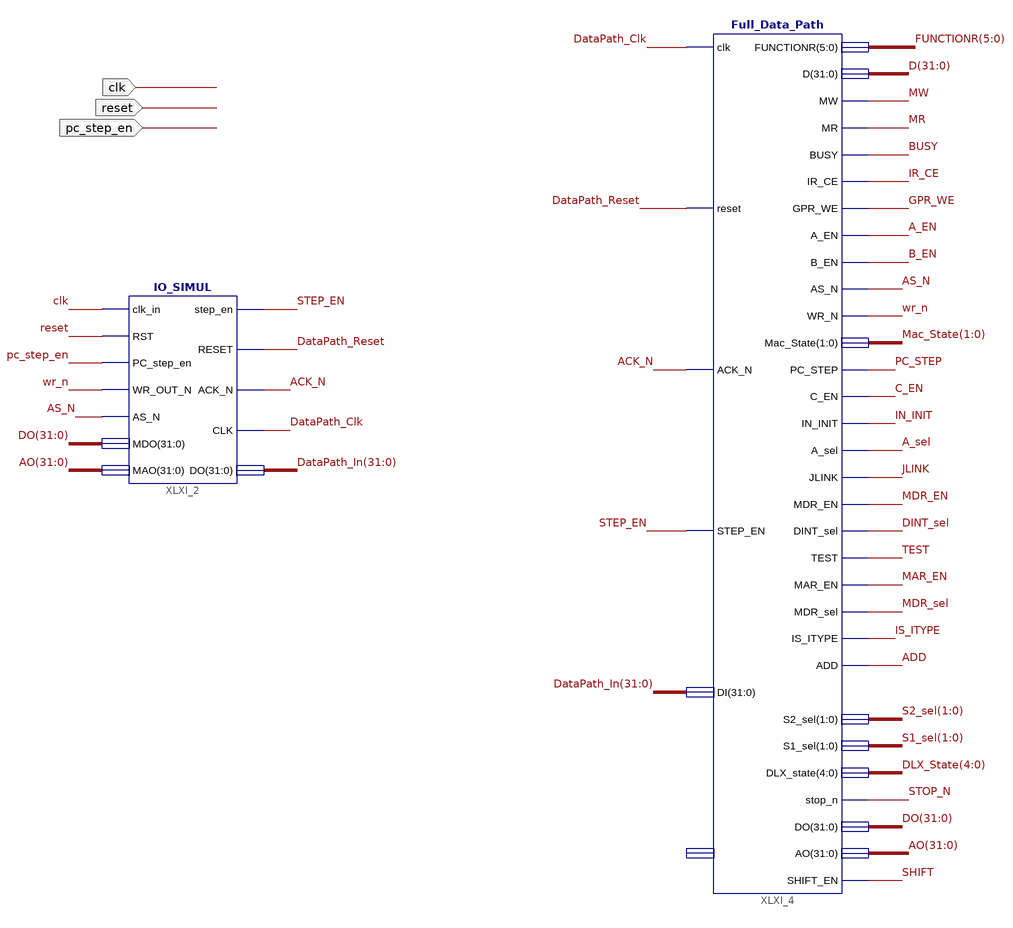
[diagram p0: schematic sheet 1]
// Xilinx ISE schematic IOSIM_DATA_P.sch (spartan6) as structural Verilog: 2 symbols, 3 ports
module IOSIM_DATA_P (
  input  reset,
  input  clk,
  input  pc_step_en
);

  wire A_EN, A_sel, ACK_N, ADD, AS_N, B_EN, BUSY, C_EN, DataPath_Clk, DataPath_Reset, DINT_sel, GPR_WE,
       IN_INIT, IR_CE, IS_ITYPE, JLINK, MAR_EN, MDR_EN, MDR_sel, MR, MW, PC_STEP, SHIFT, STEP_EN, STOP_N,
       TEST, wr_n;
  wire [1:0] Mac_State, S1_sel, S2_sel;
  wire [4:0] DLX_State;
  wire [5:0] FUNCTIONR;
  wire [31:0] AO, D, DataPath_In, DO;

  Full_Data_Path XLXI_4 (
    .clk(DataPath_Clk), .reset(DataPath_Reset), .ACK_N(ACK_N), .STEP_EN(STEP_EN), .DI(DataPath_In),
    .FUNCTIONR(FUNCTIONR), .D(D), .MW(MW), .MR(MR), .BUSY(BUSY), .IR_CE(IR_CE), .GPR_WE(GPR_WE), .A_EN(A_EN),
    .B_EN(B_EN), .AS_N(AS_N), .WR_N(wr_n), .Mac_State(Mac_State), .PC_STEP(PC_STEP), .C_EN(C_EN),
    .IN_INIT(IN_INIT), .A_sel(A_sel), .JLINK(JLINK), .MDR_EN(MDR_EN), .DINT_sel(DINT_sel), .TEST(TEST),
    .MAR_EN(MAR_EN), .MDR_sel(MDR_sel), .IS_ITYPE(IS_ITYPE), .ADD(ADD), .S2_sel(S2_sel), .S1_sel(S1_sel),
    .DLX_state(DLX_State), .stop_n(STOP_N), .DO(DO), .AO(AO), .SHIFT_EN(SHIFT));  // open: DD
  IO_SIMUL XLXI_2 (
    .clk_in(clk), .RST(reset), .PC_step_en(pc_step_en), .WR_OUT_N(wr_n), .AS_N(AS_N), .MDO(DO), .MAO(AO),
    .step_en(STEP_EN), .RESET(DataPath_Reset), .ACK_N(ACK_N), .CLK(DataPath_Clk), .DO(DataPath_In));
endmodule
